# EAGLE design ButtonBoard (EAGLE 9.6.2)
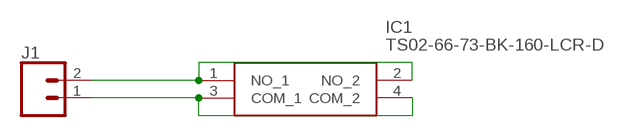
[diagram p0: schematic, sheet 1]

## Parts
IC1  TS02-66-73-BK-160-LCR-D  [TS026673BK160LCRD]
J1  CONN_02  [1X02]

## Nets
N$1: IC1.1(NO_1) IC1.2(NO_2) J1.2
N$2: IC1.3(COM_1) IC1.4(COM_2) J1.1

## Library data of the parts
IC1 = SamacSys_Parts:TS02-66-73-BK-160-LCR-D: Tactile Switches 6 x 6 mm, 7.3 mm Act Height, 160 gf, Black, Long Crimped, Through Hole, SPST, Source: Datasheet <https://www.cuidevices.com/product/resource/pdf/ts02.pdf>; DESCRIPTION: Tactile Switches 6 x 6 mm, 7.3 mm Act Height, 160 gf, Black, Long Crimped, Through Hole, SPST,; HEIGHT: 7.5mm; MANUFACTURER_NAME: CUI Devices; MANUFACTURER_PART_NUMBER: TS02-66-73-BK-160-LCR-D; MOUSER_PART_NUMBER: 179-TS026673BK160LCR; MOUSER_PRICE-STOCK: https://www.mouser.co.uk/ProductDetail/CUI-Devices/TS02-66-73-BK-160-LCR-D?qs=A6eO%252BMLsxmRS0d91%252BbnBQQ%3D%3D
J1 = SparkFun-Connectors:CONN_02: Multi connection point. Often used as Generic Header-pin footprint for 0.1 inch spaced/style header connections On any of the 0.1 inch spaced packages, you can populate with these: Break Away Headers - Straight <https://www.sparkfun.com/products/116> (PRT-00116) Break Away Male Headers - Right Angle <https://www.sparkfun.com/products/553> (PRT-00553) Female Headers <https://www.sparkfun.com/products/115> (PRT-00115) Break Away Headers - Machine Pin <https://www.sparkfun.com/products/117> (PRT-00117) Break Away Female Headers - Swiss Machine Pin <https://www.sparkfun.com/products/743> (PRT-00743) For SCREWTERMINALS and SPRING TERMINALS visit here: Screw Terimnals on SparkFun.com <https://www.sparkfun.com/search/results?term=Screw+Terminals> (5mm/3.5mm/2.54mm spacing) This device is also useful as a general connection point to wire up your design to another part of your project. Our various solder wires solder well into these plated through hole pads. Hook-Up Wire - Assortment (Stranded, 22 AWG) <https://www.sparkfun.com/products/11375> (PRT-11375) Hook-Up Wire - Assortment (Solid Core, 22 AWG) <https://www.sparkfun.com/products/11367> (PRT-11367) View the entire wire category on our website here <https://www.sparkfun.com/categories/141> Special notes: Molex polarized connector foot print use with: PRT-08233 with associated crimp pins and housings. 2.54_SCREWTERM for use with PRT-10571. 3.5mm Screw Terminal footprints for PRT-08084 5mm Screw Terminal footprints for use with PRT-08432

## Board
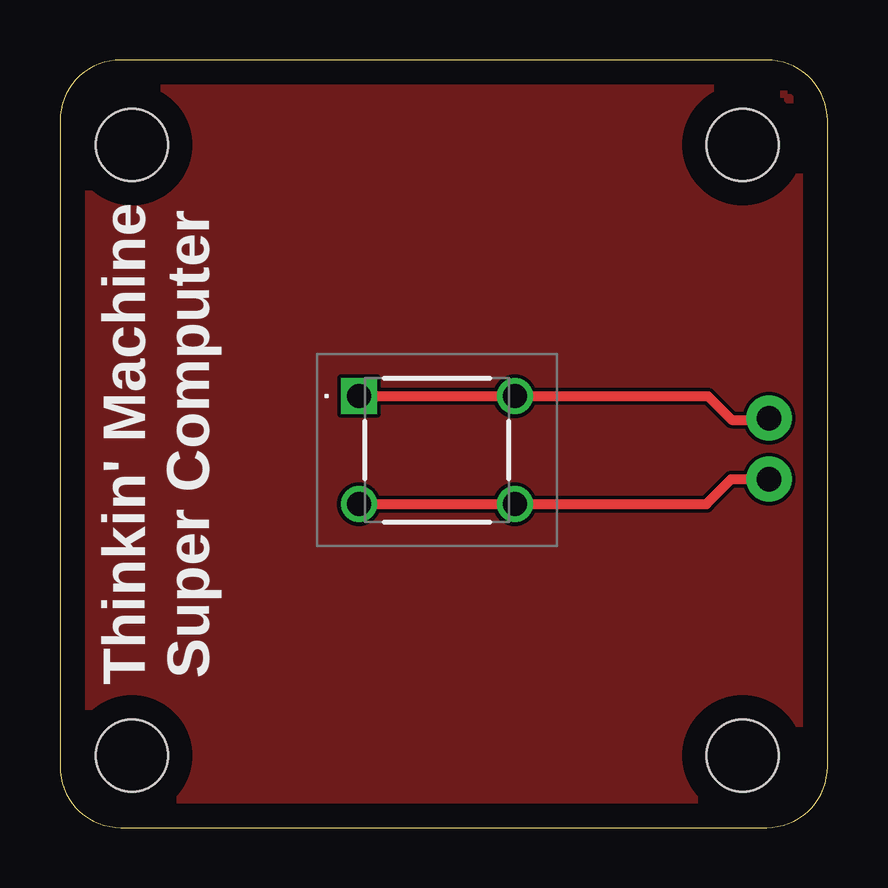
[diagram p1: board, top side]
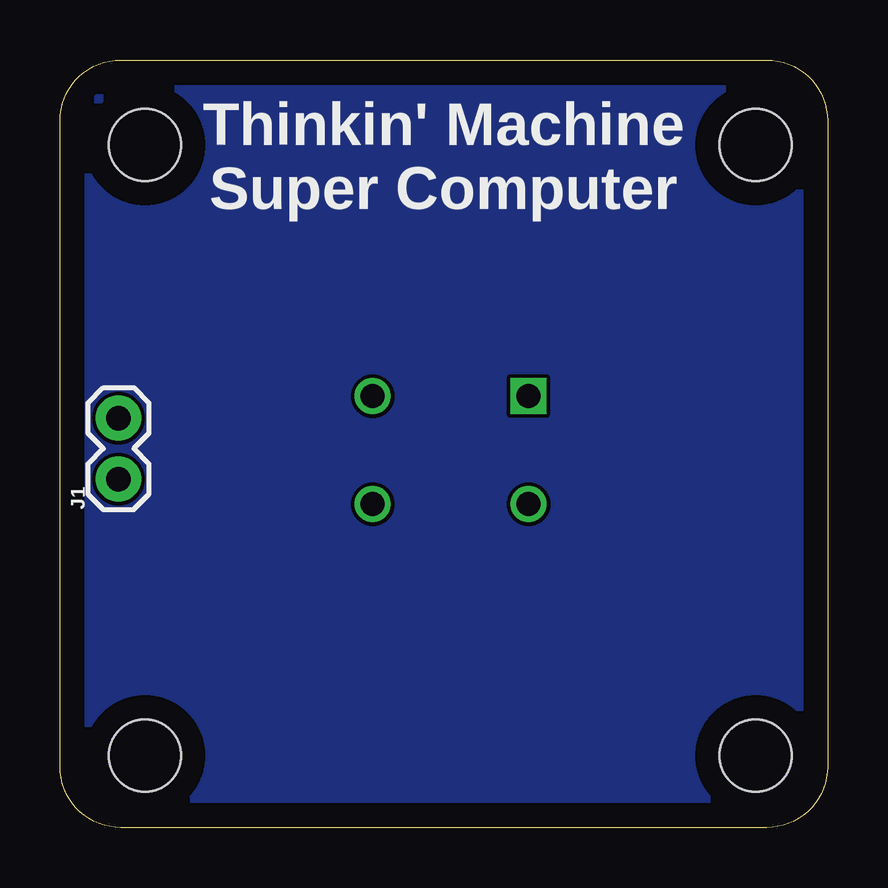
[diagram p2: board, bottom side, seen from below]

Size 32 x 32 mm. Coordinates in mm from the lower left corner, seen from the top.
Outline: 0,29.46 0,2.54 arc90 2.54,0 29.46,0 arc90 32,2.54 32,29.46 arc90 29.46,32 2.54,32 arc90 0,29.46
Copper layers (1*16): Top 0.035mm / dielectric 1.5mm / Bottom 0.035mm
Design rules "default": minimum track width 6mil, minimum drill 0.35mm, track to track 6mil, track to pad 6mil, pad to pad 6mil, via to via 6mil, smd to smd 6mil, copper to edge 40mil, drill to drill 6mil, minimum pad ring 10mil, minimum via ring 8mil, stop-mask expansion 4mil, vias tented up to drill 0mil, thermal gap 10mil
Holes 3 mm at 3,3 3,28.46 28.46,3 28.46,28.46

### Footprints (pad centres in the part's own frame; a part is rotated, then mirrored left to right if it is on the bottom)
TS026673BK160LCRD = drill 1 pad 1.5 square: 1 0,0 | drill 1 pad 1.5: 2 6.5,0; 3 0,-4.5; 4 6.5,-4.5
1X02 = drill 1.016 pad 1.88: 1 0,0; 2 2.54,0

### Placement (x,y rotation side)
IC1  12.46,17.99 0 top
J1  29.56,14.53 90 bottom

### Tracks (layer width: path | path; a pad name or v marks a point on that pad's centre or on a via)
GND
  pour Bottom: 0,32 32,32 32,0 0,0
N$1
  Top 0.406: IC1.1 IC1.2 27.01,17.99 28,17 29.5,17 J1.2
N$2
  Top 0.406: IC1.3 IC1.4 26.95,13.49 27.99,14.53 J1.1
VCC
  pour Top: 0,32 32,32 32,0 0,0

### Text on the board
tPlace: Thinkin' Machine / Super Computer
bPlace: Thinkin' Machine / Super Computer